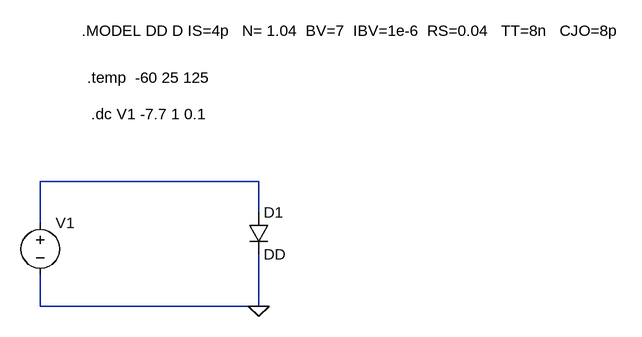
[diagram p0: schematic Draft1.asc]
Draft1.asc, the LTspice schematic file:
Version 4
SHEET 1 884 680
WIRE 272 208 -64 208
WIRE 272 256 272 208
WIRE -64 272 -64 208
WIRE -64 400 -64 352
WIRE 272 400 272 320
WIRE 272 400 -64 400
FLAG 272 400 0
SYMBOL voltage -64 256 R0
SYMATTR InstName V1
SYMATTR Value ""
SYMBOL diode 256 256 R0
SYMATTR InstName D1
SYMATTR Value DD
TEXT 0 -24 Left 2 !.MODEL DD D IS=4p   N= 1.04  BV=7  IBV=1e-6  RS=0.04   TT=8n   CJO=8p
TEXT 8 48 Left 2 !.temp  -60 25 125
TEXT 14 104 Left 2 !.dc V1 -7.7 1 0.1

The netlist it stands for:
* Draft1.asc
V1 N001 0
D1 N001 0 DD
.model D D
.lib standard.dio
.MODEL DD D IS=4p   N= 1.04  BV=7  IBV=1e-6  RS=0.04   TT=8n   CJO=8p
.temp  -60 25 125
.dc V1 -7.7 1 0.1
.backanno
.end